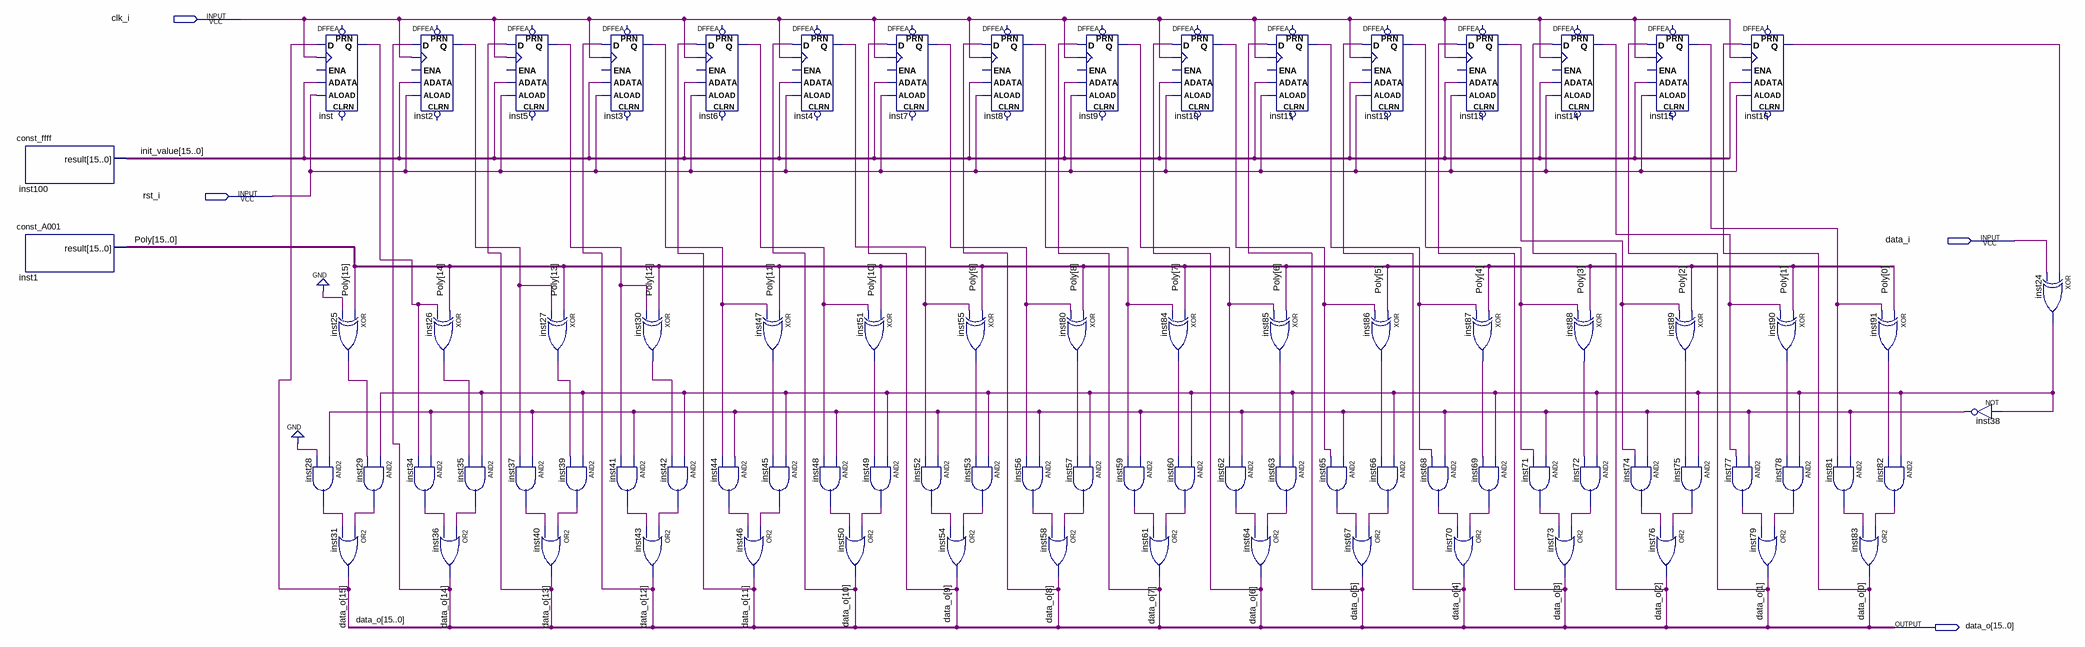
[diagram p0: schematic sheet]
// Quartus schematic CRC_16_ANSI.bdf as structural Verilog: 84 symbols, 4 pins
module CRC_16_ANSI (
  input  clk_i,
  input  rst_i,
  input  data_i,
  output [15:0] data_o
);

  wire inst2_q, inst3_q, inst4_q, inst5_q, inst6_q, inst7_q, inst8_q, inst9_q, inst10_q, inst11_q, inst12_q,
       inst13_q, inst14_q, inst15_q, inst16_q, inst24_out, inst25_out, inst26_out, inst27_out, inst30_out,
       inst38_out, inst47_out, inst51_out, inst55_out, inst80_out, inst84_out, inst85_out, inst86_out,
       inst87_out, inst88_out, inst89_out, inst90_out, inst91_out, inst_q, not_xor_0, not_xor_1, not_xor_2,
       not_xor_3, not_xor_4, not_xor_5, not_xor_6, not_xor_7, not_xor_8, not_xor_9, not_xor_10, not_xor_11,
       not_xor_12, not_xor_13, not_xor_14, not_xor_15, XOR_Poly_0, XOR_Poly_1, XOR_Poly_2, XOR_Poly_3,
       XOR_Poly_4, XOR_Poly_5, XOR_Poly_6, XOR_Poly_7, XOR_Poly_8, XOR_Poly_9, XOR_Poly_10, XOR_Poly_11,
       XOR_Poly_12, XOR_Poly_13, XOR_Poly_14, XOR_Poly_15;
  wire [15:0] init_value, Poly;

  const_ffff inst100 (.result(init_value));
  const_A001 inst1 (.result(Poly));
  DFFEA inst (.ALOAD(rst_i), .ADATA(init_value[0]), .CLK(clk_i), .D(data_o[15]), .Q(inst_q));  // open: PRN, ENA, CLRN
  and inst28 (not_xor_0, inst38_out, 1'b0);
  xor inst25 (inst25_out, Poly[15], 1'b0);
  and inst29 (XOR_Poly_0, inst24_out, inst25_out);
  or inst31 (data_o[15], XOR_Poly_0, not_xor_0);
  DFFEA inst2 (.ALOAD(rst_i), .ADATA(init_value[1]), .CLK(clk_i), .D(data_o[14]), .Q(inst2_q));  // open: PRN, ENA, CLRN
  xor inst26 (inst26_out, Poly[14], inst_q);
  and inst34 (not_xor_1, inst38_out, inst_q);
  and inst35 (XOR_Poly_1, inst24_out, inst26_out);
  or inst36 (data_o[14], XOR_Poly_1, not_xor_1);
  DFFEA inst5 (.ALOAD(rst_i), .ADATA(init_value[2]), .CLK(clk_i), .D(data_o[13]), .Q(inst5_q));  // open: PRN, ENA, CLRN
  and inst37 (not_xor_2, inst38_out, inst2_q);
  xor inst27 (inst27_out, Poly[13], inst2_q);
  and inst39 (XOR_Poly_2, inst24_out, inst27_out);
  or inst40 (data_o[13], XOR_Poly_2, not_xor_2);
  DFFEA inst3 (.ALOAD(rst_i), .ADATA(init_value[3]), .CLK(clk_i), .D(data_o[12]), .Q(inst3_q));  // open: PRN, ENA, CLRN
  and inst41 (not_xor_3, inst38_out, inst5_q);
  xor inst30 (inst30_out, Poly[12], inst5_q);
  and inst42 (XOR_Poly_3, inst24_out, inst30_out);
  or inst43 (data_o[12], XOR_Poly_3, not_xor_3);
  DFFEA inst6 (.ALOAD(rst_i), .ADATA(init_value[4]), .CLK(clk_i), .D(data_o[11]), .Q(inst6_q));  // open: PRN, ENA, CLRN
  and inst44 (not_xor_4, inst38_out, inst3_q);
  xor inst47 (inst47_out, Poly[11], inst3_q);
  and inst45 (XOR_Poly_4, inst24_out, inst47_out);
  or inst46 (data_o[11], XOR_Poly_4, not_xor_4);
  DFFEA inst4 (.ALOAD(rst_i), .ADATA(init_value[5]), .CLK(clk_i), .D(data_o[10]), .Q(inst4_q));  // open: PRN, ENA, CLRN
  and inst48 (not_xor_5, inst38_out, inst6_q);
  xor inst51 (inst51_out, Poly[10], inst6_q);
  and inst49 (XOR_Poly_5, inst24_out, inst51_out);
  or inst50 (data_o[10], XOR_Poly_5, not_xor_5);
  DFFEA inst7 (.ALOAD(rst_i), .ADATA(init_value[6]), .CLK(clk_i), .D(data_o[9]), .Q(inst7_q));  // open: PRN, ENA, CLRN
  and inst52 (not_xor_6, inst38_out, inst4_q);
  DFFEA inst8 (.ALOAD(rst_i), .ADATA(init_value[7]), .CLK(clk_i), .D(data_o[8]), .Q(inst8_q));  // open: PRN, ENA, CLRN
  xor inst55 (inst55_out, Poly[9], inst4_q);
  and inst53 (XOR_Poly_6, inst24_out, inst55_out);
  or inst54 (data_o[9], XOR_Poly_6, not_xor_6);
  and inst56 (not_xor_7, inst38_out, inst7_q);
  DFFEA inst9 (.ALOAD(rst_i), .ADATA(init_value[8]), .CLK(clk_i), .D(data_o[7]), .Q(inst9_q));  // open: PRN, ENA, CLRN
  xor inst80 (inst80_out, Poly[8], inst7_q);
  and inst57 (XOR_Poly_7, inst24_out, inst80_out);
  or inst58 (data_o[8], XOR_Poly_7, not_xor_7);
  and inst59 (not_xor_8, inst38_out, inst8_q);
  DFFEA inst10 (
    .ALOAD(rst_i), .ADATA(init_value[9]), .CLK(clk_i), .D(data_o[6]), .Q(inst10_q));  // open: PRN, ENA, CLRN
  xor inst84 (inst84_out, Poly[7], inst8_q);
  and inst60 (XOR_Poly_8, inst24_out, inst84_out);
  or inst61 (data_o[7], XOR_Poly_8, not_xor_8);
  and inst62 (not_xor_9, inst38_out, inst9_q);
  DFFEA inst11 (
    .ALOAD(rst_i), .ADATA(init_value[10]), .CLK(clk_i), .D(data_o[5]), .Q(inst11_q));  // open: PRN, ENA, CLRN
  xor inst85 (inst85_out, Poly[6], inst9_q);
  and inst63 (XOR_Poly_9, inst24_out, inst85_out);
  or inst64 (data_o[6], XOR_Poly_9, not_xor_9);
  and inst65 (not_xor_10, inst38_out, inst10_q);
  DFFEA inst12 (
    .ALOAD(rst_i), .ADATA(init_value[11]), .CLK(clk_i), .D(data_o[4]), .Q(inst12_q));  // open: PRN, ENA, CLRN
  xor inst86 (inst86_out, Poly[5], inst10_q);
  and inst66 (XOR_Poly_10, inst24_out, inst86_out);
  or inst67 (data_o[5], XOR_Poly_10, not_xor_10);
  and inst68 (not_xor_11, inst38_out, inst11_q);
  DFFEA inst13 (
    .ALOAD(rst_i), .ADATA(init_value[12]), .CLK(clk_i), .D(data_o[3]), .Q(inst13_q));  // open: PRN, ENA, CLRN
  xor inst87 (inst87_out, Poly[4], inst11_q);
  and inst69 (XOR_Poly_11, inst24_out, inst87_out);
  or inst70 (data_o[4], XOR_Poly_11, not_xor_11);
  and inst71 (not_xor_12, inst38_out, inst12_q);
  DFFEA inst14 (
    .ALOAD(rst_i), .ADATA(init_value[13]), .CLK(clk_i), .D(data_o[2]), .Q(inst14_q));  // open: PRN, ENA, CLRN
  xor inst88 (inst88_out, Poly[3], inst12_q);
  and inst72 (XOR_Poly_12, inst24_out, inst88_out);
  or inst73 (data_o[3], XOR_Poly_12, not_xor_12);
  and inst74 (not_xor_13, inst38_out, inst13_q);
  DFFEA inst15 (
    .ALOAD(rst_i), .ADATA(init_value[14]), .CLK(clk_i), .D(data_o[1]), .Q(inst15_q));  // open: PRN, ENA, CLRN
  xor inst89 (inst89_out, Poly[2], inst13_q);
  and inst75 (XOR_Poly_13, inst24_out, inst89_out);
  or inst76 (data_o[2], XOR_Poly_13, not_xor_13);
  DFFEA inst16 (
    .ALOAD(rst_i), .ADATA(init_value[15]), .CLK(clk_i), .D(data_o[0]), .Q(inst16_q));  // open: PRN, ENA, CLRN
  and inst77 (not_xor_14, inst38_out, inst14_q);
  xor inst90 (inst90_out, Poly[1], inst14_q);
  and inst78 (XOR_Poly_14, inst24_out, inst90_out);
  or inst79 (data_o[1], XOR_Poly_14, not_xor_14);
  and inst81 (not_xor_15, inst38_out, inst15_q);
  xor inst91 (inst91_out, Poly[0], inst15_q);
  and inst82 (XOR_Poly_15, inst24_out, inst91_out);
  or inst83 (data_o[0], XOR_Poly_15, not_xor_15);
  not inst38 (inst38_out, inst24_out);
  xor inst24 (inst24_out, inst16_q, data_i);
endmodule
